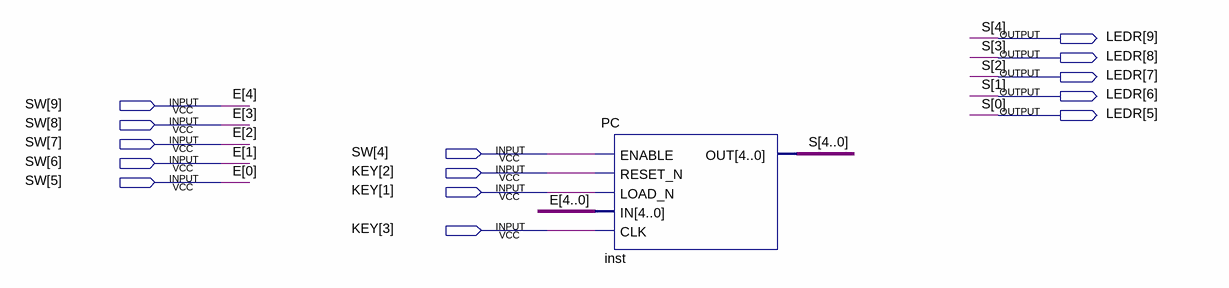
[diagram p0: schematic sheet]
// Quartus schematic Placa.bdf as structural Verilog: 1 symbols, 14 pins
module Placa (
  input  [9:4] SW,
  input  [3:1] KEY,
  output [9:5] LEDR
);

  PC inst (.ENABLE(SW[4]), .RESET_N(KEY[2]), .LOAD_N(KEY[1]), .IN(SW[9:5]), .CLK(KEY[3]), .OUT(LEDR));

  // Other names for the same wires on the sheet: E[4:0] = SW[9:5]; S[4:0] = LEDR
endmodule
